# Altium project Dot_Matrix_V1.1.PrjPcb
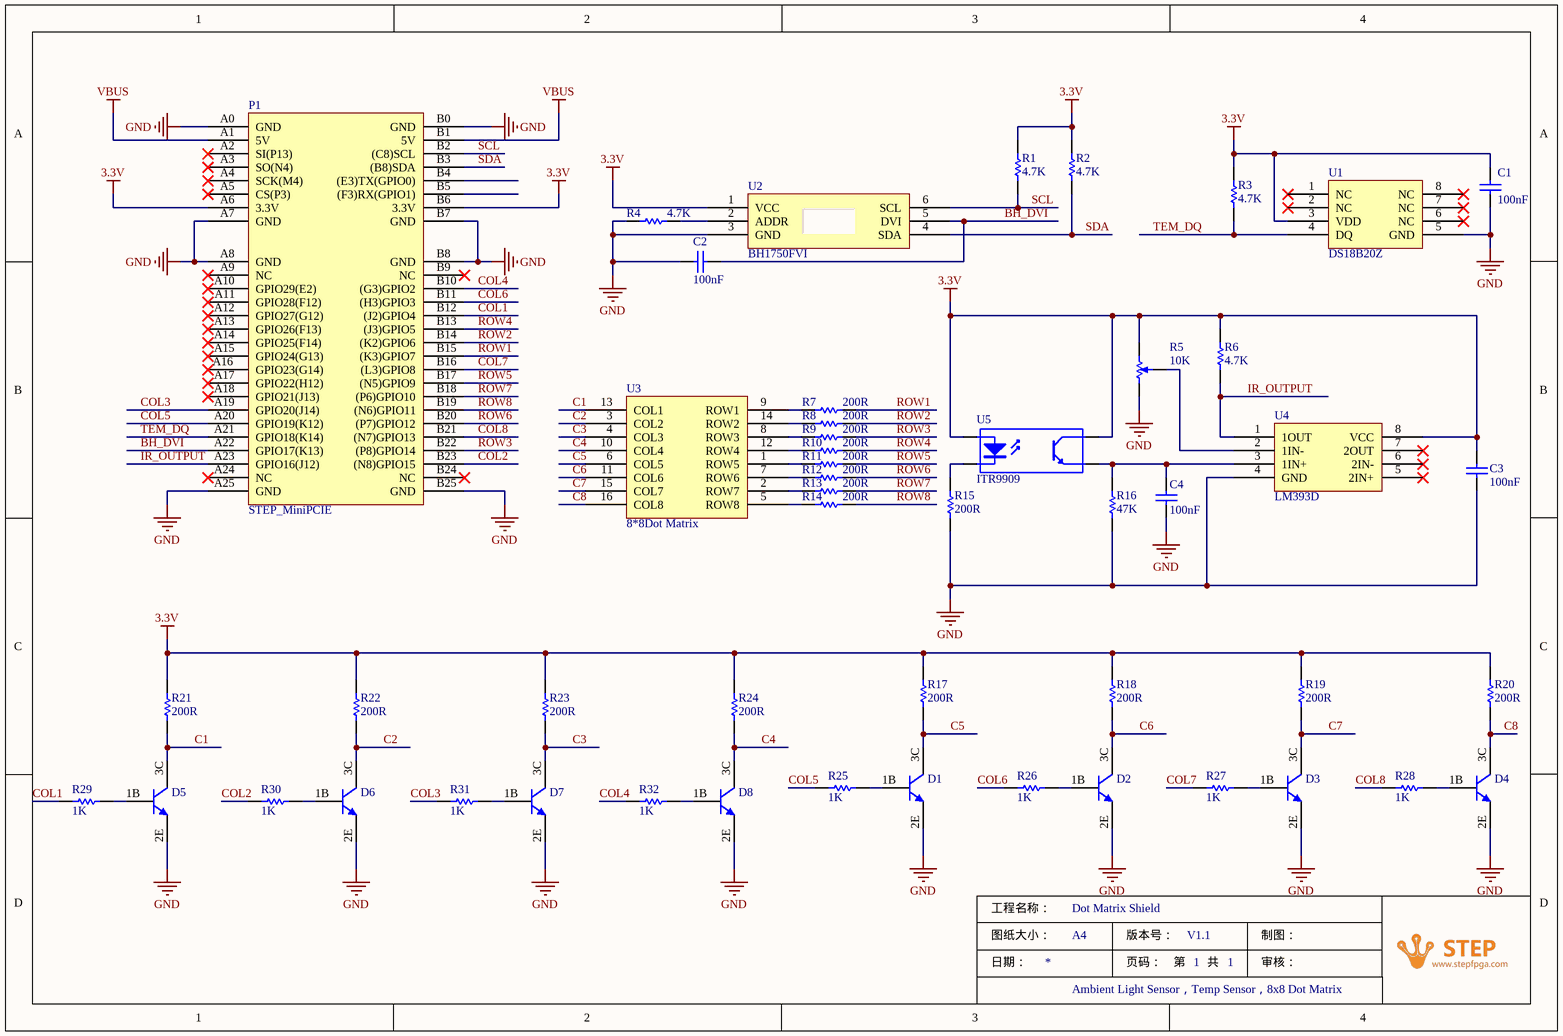
[diagram p0: Dot_matrix_V1.1.SchDoc]
1 sheet, 50 parts. Net scope: global (net labels, ports and power ports of the same name join across sheets).
Board file: PCB1.PcbDoc

## Sheet Dot_matrix_V1.1.SchDoc: Dot Matrix Shield
size A4; Revision: V1.1; SheetNumber: 1; SheetTotal: 1; Function: Ambient Light Sensor，Temp Sensor，8x8 Dot Matrix

### Parts
C1  100nF  [CAP0603]
C2  100nF  [CAP0603]
C3  100nF  [CAP0603]
C4  100nF  [CAP0603]
D1  s9013  [SOT-23 s9013]  (value not drawn)
D2  s9013  [SOT-23 s9013]  (value not drawn)
D3  s9013  [SOT-23 s9013]  (value not drawn)
D4  s9013  [SOT-23 s9013]  (value not drawn)
D5  s9013  [SOT-23 s9013]  (value not drawn)
D6  s9013  [SOT-23 s9013]  (value not drawn)
D7  s9013  [SOT-23 s9013]  (value not drawn)
D8  s9013  [SOT-23 s9013]  (value not drawn)
P1  STEP_MiniPCIE  [STEP_miniPCI-E]
R1  4.7K  [RES0603]
R2  4.7K  [RES0603]
R3  4.7K  [RES0603]
R4  4.7K  [RES0603]
R5  10K  [POT3MM]
R6  4.7K  [RES0603]
R7  200R  [RES0603]
R8  200R  [RES0603]
R9  200R  [RES0603]
R10  200R  [RES0603]
R11  200R  [RES0603]
R12  200R  [RES0603]
R13  200R  [RES0603]
R14  200R  [RES0603]
R15  200R  [RES0603]
R16  47K  [RES0603]
R17  200R  [RES0603]
R18  200R  [RES0603]
R19  200R  [RES0603]
R20  200R  [RES0603]
R21  200R  [RES0603]
R22  200R  [RES0603]
R23  200R  [RES0603]
R24  200R  [RES0603]
R25  1K  [RES0603]
R26  1K  [RES0603]
R27  1K  [RES0603]
R28  1K  [RES0603]
R29  1K  [RES0603]
R30  1K  [RES0603]
R31  1K  [RES0603]
R32  1K  [RES0603]
U1  DS18B20Z  [SOP8]
U2  BH1750FVI  [WSOF6I]
U3  8*8Dot Matrix  [8*8Dot Matrix]
U4  LM393D  [SOP8]
U5  ITR9909  [ITR9909]

### Nets
3.3V: C1.2 C3.2 P1.A6(3.3V) P1.B6(3.3V) R1.2 R2.2 R3.2 R5.CW(+) R6.2 R17.2 R18.2 R19.2 R20.2 R21.2 R22.2 R23.2 R24.2 U1.3(VDD) U2.1(VCC) U4.8(VCC) U5.2 U5.4
GND: C1.1 C2.2 C3.1 C4.1 D1.2E D2.2E D3.2E D4.2E D5.2E D6.2E D7.2E D8.2E P1.A0(GND) P1.A7(GND) P1.A8(GND) P1.A25(GND) P1.B0(GND) P1.B7(GND) P1.B8(GND) P1.B25(GND) R4.1 R5.CCW(-) R15.1 R16.1 U1.5(GND) U2.3(GND) U4.4(GND)
VBUS: P1.A1(5V) P1.B1(5V)
BH_DVI: C2.1 P1.A22(GPIO17(K13)) U2.5(DVI)
C1: D5.3C R21.1 U3.13(COL1)
C2: D6.3C R22.1 U3.3(COL2)
C3: D7.3C R23.1 U3.4(COL3)
C4: D8.3C R24.1 U3.10(COL4)
C5: D1.3C R17.1 U3.6(COL5)
C6: D2.3C R18.1 U3.11(COL6)
C7: D3.3C R19.1 U3.15(COL7)
C8: D4.3C R20.1 U3.16(COL8)
COL1: P1.B12((J2)GPIO4) R29.1
COL2: P1.B23((N8)GPIO15) R30.1
COL3: P1.A19(GPIO20(J14)) R31.1
COL4: P1.B10((G3)GPIO2) R32.1
COL5: P1.A20(GPIO19(K12)) R25.1
COL6: P1.B11((H3)GPIO3) R26.1
COL7: P1.B16((L3)GPIO8) R27.1
COL8: P1.B21((N7)GPIO13) R28.1
IR_OUTPUT: P1.A23(GPIO16(J12)) R6.1 U4.1(1OUT)
ROW1: P1.B15((K3)GPIO7) R7.2
ROW2: P1.B14((K2)GPIO6) R8.2
ROW3: P1.B22((P8)GPIO14) R9.2
ROW4: P1.B13((J3)GPIO5) R10.2
ROW5: P1.B17((N5)GPIO9) R11.2
ROW6: P1.B20((P7)GPIO12) R12.2
ROW7: P1.B18((P6)GPIO10) R13.2
ROW8: P1.B19((N6)GPIO11) R14.2
SCL: P1.B2((C8)SCL) R1.1 U2.6(SCL)
SDA: P1.B3((B8)SDA) R2.1 U2.4(SDA)
TEM_DQ: P1.A21(GPIO18(K14)) R3.1 U1.4(DQ)
NetC4_2: C4.2 R16.2 U4.3(1IN+) U5.3
NetD1_1B: D1.1B R25.2
NetD2_1B: D2.1B R26.2
NetD3_1B: D3.1B R27.2
NetD4_1B: D4.1B R28.2
NetD5_1B: D5.1B R29.2
NetD6_1B: D6.1B R30.2
NetD7_1B: D7.1B R31.2
NetD8_1B: D8.1B R32.2
NetR4_2: R4.2 U2.2(ADDR)
NetR5_W: R5.W U4.2(1IN-)
NetR7_1: R7.1 U3.9(ROW1)
NetR8_1: R8.1 U3.14(ROW2)
NetR9_1: R9.1 U3.8(ROW3)
NetR10_1: R10.1 U3.12(ROW4)
NetR11_1: R11.1 U3.1(ROW5)
NetR12_1: R12.1 U3.7(ROW6)
NetR13_1: R13.1 U3.2(ROW7)
NetR14_1: R14.1 U3.5(ROW8)
NetR15_2: R15.2 U5.1

Not connected (* = marked no-connect by the designer): P1 A2(SI(P13))* A3(SO(N4))* A4(SCK(M4))* A5(CS(P3))* A9(NC)* A10(GPIO29(E2))* A11(GPIO28(F12))* A12(GPIO27(G12))* A13(GPIO26(F13))* A14(GPIO25(F14))* A15(GPIO24(G13))* A16(GPIO23(G14))* A17(GPIO22(H12))* A18(GPIO21(J13))* A24(NC)* B4((E3)TX(GPIO0)) B5((F3)RX(GPIO1)) B9(NC)* B24(NC)*; U1 1(NC)* 2(NC)* 6(NC)* 7(NC)* 8(NC)*; U4 5(2IN+)* 6(2IN-)* 7(2OUT)*

### Notes on the sheet
- 工程名称：
- 图纸大小：
- 日期：
- A4
- 版本号：
- 页码：
- 第
- 共
- 制图：
- 审核：

### Library data of the parts
C1-C4 = Cap: Capacitor; Manufacturer: -; Partnumber: -; Value: 100nF
D1-D8 = s9013: NPN三极管; Partnumber: s9013; Manufacturer: -; Value: s9013
P1 = STEP_MiniPCIE: 8mm MiniPCIE interface; Partnumber: -; Manufacturer: -; Value: STEP_MiniPCIE
R1-R4 R6-R32 = Res: Partnumber: -; Manufacturer: -
  R1-R4 R6: Value: 4.7K
  R7-R15 R17-R24: Value: 200R
  R16: Value: 47K
  R25-R32: Value: 1K
R5 = Square Trimming Potentiometer: 可调电阻3mm*3mm; Partnumber: EXM3GSX50B14; Manufacturer: Panasonic; Value: 10K
U1 = DS18B20Z: 温度传感器DS18B20,单总线，SOP8封装; Manufacturer: Dallas; Partnumber: DS18B20Z; Value: DS18B20Z
U2 = BH1750FVI: I2C接口环境光传感器; Manufacturer: RHOM; Value: BH1750FVI; Partnumber: BH1750FVI
U3 = 8*8Dot Matrix: 8*8LED点阵，尺寸为32mm*32mm , 共阴; Partnumber: 1088AS; Value: 8*8Dot Matrix; Manufacturer: -
U4 = LM393D: 双路电压比较器; Manufacturer: Texas Instruments; Partnumber: LM393D; Value: LM393D
U5 = ITR9909: 红外对管，4pins; Manufacturer: EVERLIGHT  ELECTRONICS; Partnumber: ITR9909; Value: ITR9909